# EAGLE design mini-ecg1 (EAGLE 9.4.2)
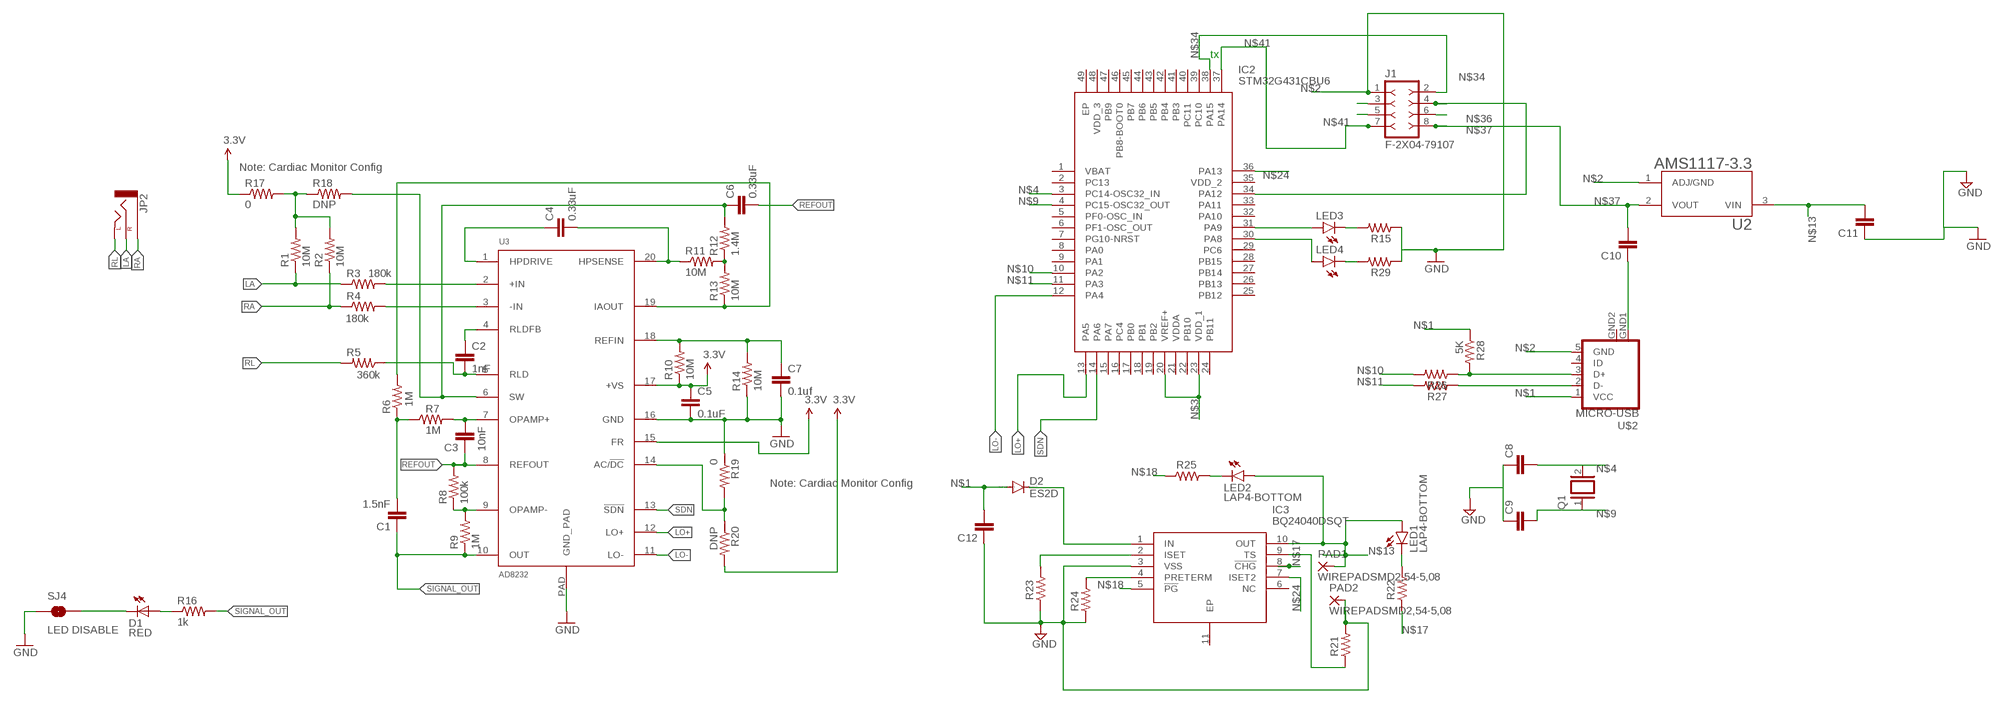
[diagram p0: schematic, sheet 1]

## Parts
C1  1.5nF  CAP0603-CAP  [0603-CAP]
C2  1nF  CAP0603-CAP  [0603-CAP]
C3  10nF  CAP0603-CAP  [0603-CAP]
C4  0.33uF  CAP0805  [0805]
C5  0.1uF  CAP0603-CAP  [0603-CAP]
C6  0.33uF  CAP0805  [0805]
C7  0.1uf  CAP0603-CAP  [0603-CAP]
C8  C-EUC1206  [C1206]
C9  C-EUC1206  [C1206]
C10  C-EUC1206  [C1206]
C11  C-EUC1206  [C1206]
C12  C-EUC1206  [C1206]
D1  RED  LED-RED0603  [LED-0603]
D2  ES2D  [SMB]
IC2  STM32G431CBU6  [QFN50P700X700X65-49N]
IC3  BQ24040DSQT  [SON40P200X200X80-11N]
J1  F-2X04-79107  [79107-08]
JP2  AUDIO-JACKSMD2  [AUDIO-JACK-3.5MM-SMD]
LED1  LAP4-BOTTOM  [P47F-BOTTOM]
LED2  LAP4-BOTTOM  [P47F-BOTTOM]
LED3  LEDCHIPLED_1206  [CHIPLED_1206]
LED4  LEDCHIPLED_1206  [CHIPLED_1206]
PAD1  WIREPADSMD2,54-5,08  [SMD2,54-5,08]
PAD2  WIREPADSMD2,54-5,08  [SMD2,54-5,08]
Q1  XTAL/S  [QS]
R1  10M  RESISTOR0603-RES  [0603-RES]
R2  10M  RESISTOR0603-RES  [0603-RES]
R3  180k  RESISTOR0603-RES  [0603-RES]
R4  180k  RESISTOR0603-RES  [0603-RES]
R5  360k  RESISTOR0603-RES  [0603-RES]
R6  1M  RESISTOR0603-RES  [0603-RES]
R7  1M  RESISTOR0603-RES  [0603-RES]
R8  100k  RESISTOR0603-RES  [0603-RES]
R9  1M  RESISTOR0603-RES  [0603-RES]
R10  10M  RESISTOR0603-RES  [0603-RES]
R11  10M  RESISTOR0603-RES  [0603-RES]
R12  1.4M  RESISTOR0603-RES  [0603-RES]
R13  10M  RESISTOR0603-RES  [0603-RES]
R14  10M  RESISTOR0603-RES  [0603-RES]
R15  R_1206  [R1206]
R16  1k  1K-1%  [0603-RES]
R17  0  0OHM1/10W5%(0603)  [0603]
R18  DNP  0OHM1/10W5%(0603)  [0603]
R19  0  0OHM1/10W5%(0603)  [0603]
R20  DNP  0OHM1/10W5%(0603)  [0603]
R21  R_1206  [R1206]
R22  R_1206  [R1206]
R23  R_1206  [R1206]
R24  R_1206  [R1206]
R25  R_1206  [R1206]
R26  R_1206  [R1206]
R27  R_1206  [R1206]
R28  5K  R_1206  [R1206]
R29  R_1206  [R1206]
SJ4  LED DISABLE  SOLDERJUMPERTRACE  [SJ_2S-TRACE]
U2  AMS1117-3.3  [SOT229P700X180-4N]
U3  AD8232  [LFCSP_20]
U$2  MICRO-USB  [MICRO-USB]

## Nets
3.3V: C5.1 R10.1 R17.1 R20.2 U3.15(FR) U3.17(+VS)
GND: C5.2 C7.2 C11.1 C12.1 IC3.3(VSS) PAD2.1(P) R14.1 R19.1 R21.2 R23.1 R24.1 SJ4.1 U3.16(GND) U3.PAD(GND_PAD)
LA: JP2.RING(RIGHT) R1.1 R3.1
LO+: IC2.13(PA5) U3.12(LO+)
LO-: IC2.12(PA4) U3.11(LO-)
N$1: C12.2 D2.A R28.1 U$2.1(VCC)
N$2: J1.1 R15.1 R29.1 U2.1(ADJ/GND) U$2.5(GND) ; supply symbol labelled GND
N$3: IC2.20(VREF+) IC2.23(VDD_1) R3.2 U3.2(+IN)
N$4: IC2.3(PC14-OSC32_IN) R4.2 U3.3(-IN)
N$5: C3.2 R7.2 U3.7(OPAMP+)
N$6: C4.2 R11.1 U3.20(HPSENSE)
N$7: C7.1 R10.2 R14.2 U3.18(REFIN)
N$8: R8.1 R9.2 U3.9(OPAMP-)
N$9: C1.2 IC2.4(PC15-OSC32_OUT) R6.1 R7.1
N$10: IC2.10(PA2) R26.1 R28.2 U$2.3(D+)
N$11: IC2.11(PA3)
N$12: C10.1 U$2.GND1(GND)
N$13: C4.1 C11.2 IC3.10(OUT) LED1.A LED2.A PAD1.1(P) U2.3(VIN) U3.1(HPDRIVE)
N$14: R11.2 R12.1 R13.2
N$15: R6.2 R13.1 U3.19(IAOUT)
N$16: C6.1 R12.2 R18.2 U3.6(SW)
N$17: C2.1 IC3.8(!CHG) R22.1 U3.4(RLDFB)
N$18: C2.2 IC3.5(!PG) R5.1 R25.1 U3.5(RLD)
N$19: D1.A R16.1
N$20: R1.2 R2.2 R17.2 R18.1
N$21: D1.C SJ4.2
N$22: R19.2 R20.1 U3.14(AC/!DC)
N$23: C8.2 Q1.2
N$24: C9.2 IC2.36(PA13) IC3.7(ISET2) LED2.C Q1.1 R25.2
N$25: C8.1 C9.1
N$26: IC3.9(TS) R21.1
N$27: LED1.C R22.2
N$28: IC3.2(ISET) R23.2
N$29: IC3.4(PRETERM) R24.2
N$30: D2.C IC3.1(IN)
N$31: R27.1 U$2.2(D-)
N$32: R26.2
N$33: R27.2
N$34: IC2.38(PA15) J1.2
N$35: IC2.34(PA12) J1.4
N$36: J1.6
N$37: C10.2 J1.8 U2.2(VOUT)
N$39: J1.3
N$40: J1.5
N$41: IC2.37(PA14) J1.7
N$44: IC2.31(PA9) LED3.A
N$45: LED3.C R15.2
N$46: IC2.30(PA8) LED4.A
N$47: LED4.C R29.2
RA: JP2.SLEEVE R2.1 R4.1
REFOUT: C3.1 C6.2 R8.2 U3.8(REFOUT)
RL: JP2.TIP(LEFT) R5.2
SDN: IC2.14(PA6) U3.13(!SDN)
SIGNAL_OUT: C1.1 R9.1 R16.2 U3.10(OUT)
Unconnected: IC2.1(VBAT) IC2.2(PC13) IC2.5(PF0-OSC_IN) IC2.6(PF1-OSC_OUT) IC2.7(PG10-NRST) IC2.8(PA0) IC2.9(PA1) IC2.15(PA7) IC2.16(PC4) IC2.17(PB0) IC2.18(PB1) IC2.19(PB2) IC2.21(VDDA) IC2.22(PB10) IC2.24(PB11) IC2.25(PB12) IC2.26(PB13) IC2.27(PB14) IC2.28(PB15) IC2.29(PC6) IC2.32(PA10) IC2.33(PA11) IC2.35(VDD_2) IC2.39(PC10) IC2.40(PC11) IC2.41(PB3) IC2.42(PB4) IC2.43(PB5) IC2.44(PB6) IC2.45(PB7) IC2.46(PB8-BOOT0) IC2.47(PB9) IC2.48(VDD_3) IC2.49(EP) IC3.6(NC) IC3.11(EP) U$2.4(ID)

## Notes on the sheet
- tx
- Note: Cardiac Monitor Config
- Note: Cardiac Monitor Config

## Power pins joined to a net without a drawn wire
GND: U$2.GND2(GND)

## Library data of the parts
C1-C7 = SparkFun-Passives:CAP: Capacitor Standard 0603 ceramic capacitor, and 0.1" leaded capacitor.
C8-C12 = rcl:C-EU: CAPACITOR, European symbol; SPICEPREFIX: C
D1 = SparkFun-LED:LED-RED: Assorted Red LEDs LilyPad 1206- DIO-09912 1206- DIO-00809 0603- DIO-00819; PROD_ID: DIO-00819
D2 = diode:ES2D: DIODE super fast rectifier, 2 A
IC2 = SamacSys_Parts:STM32G431CBU6: STMICROELECTRONICS - STM32G431CBU6 - MCU, 32BIT, 170MHZ, UFQFPN-48 Source: Datasheet <https://componentsearchengine.com/Datasheets/1/STM32G431CBU6.pdf>; DESCRIPTION: STMICROELECTRONICS - STM32G431CBU6 - MCU, 32BIT, 170MHZ, UFQFPN-48; HEIGHT: 0.65mm; MANUFACTURER_NAME: STMicroelectronics; MANUFACTURER_PART_NUMBER: STM32G431CBU6; MOUSER_PART_NUMBER: 511-STM32G431CBU6; MOUSER_PRICE-STOCK: https://www.mouser.com/Search/Refine.aspx?Keyword=511-STM32G431CBU6
IC3 = SamacSys_Parts:BQ24040DSQT: 1A 1-Cell Li-Ion Battery Charger WSON10 Texas Instruments BQ24040DSQT, Battery Charge Controller, 1000mA, 10-Pin SON Source: Datasheet <http://www.ti.com/lit/ds/symlink/bq24040.pdf>; DESCRIPTION: 1A 1-Cell Li-Ion Battery Charger WSON10 Texas Instruments BQ24040DSQT, Battery Charge Controller, 1000mA, 10-Pin SON; HEIGHT: 0.8mm; MANUFACTURER_NAME: Texas Instruments; MANUFACTURER_PART_NUMBER: BQ24040DSQT; MOUSER_PART_NUMBER: 595-BQ24040DSQT; MOUSER_PRICE-STOCK: https://www.mouser.com/Search/Refine.aspx?Keyword=595-BQ24040DSQT
J1 = con-headers-jp:F-2X04-: FEMALE HEADER
JP2 = SparkFun-Connectors:AUDIO-JACK: 3.5mm Audio Jack Simple 3.5mm common PCB mount audio jack. SKU: PRT-08032; PROD_ID: CONN-10353
LED1 LED2 = led:*P4: PointLED® Enhanced Thinfilm LED TOP & BOTTOM mount LS P47F, LR P47F, LA P47F, LY P47F, LT P4SG, LB P4SG, LW P4SG Source: http://catalog.osram-os.com .. LA_LR_LS_LY_P47F_Pb_free.pdf
LED3 LED4 = led:LED: LED OSRAM: - CHIPLED LG R971, LG N971, LY N971, LG Q971, LY Q971, LO R971, LY R971 LH N974, LH R974 LS Q976, LO Q976, LY Q976 LO Q996 - Hyper CHIPLED LW Q18S LB Q993, LB Q99A, LB R99A - SideLED LS A670, LO A670, LY A670, LG A670, LP A670 LB A673, LV A673, LT A673, LW A673 LH A674 LY A675 LS A676, LA A676, LO A676, LY A676, LW A676 LS A679, LY A679, LG A679 - Hyper Micro SIDELED® LS Y876, LA Y876, LO Y876, LY Y876 LT Y87S - SmartLED LW L88C, LW L88S LB L89C, LB L89S, LG L890 LS L89K, LO L89K, LY L89K LS L896, LA L896, LO L896, LY L896 - TOPLED LS T670, LO T670, LY T670, LG T670, LP T670 LSG T670, LSP T670, LSY T670, LOP T670, LYG T670 LG T671, LOG T671, LSG T671 LB T673, LV T673, LT T673, LW T673 LH T674 LS T676, LA T676, LO T676, LY T676, LB T676, LH T676, LSB T676, LW T676 LB T67C, LV T67C, LT T67C, LS T67K, LO T67K, LY T67K, LW E67C LS E67B, LA E67B, LO E67B, LY E67B, LB E67C, LV E67C, LT E67C LW T67C LS T679, LY T679, LG T679 LS T770, LO T770, LY T770, LG T770, LP T770 LB T773, LV T773, LT T773, LW T773 LH T774 LS E675, LA E675, LY E675, LS T675 LS T776, LA T776, LO T776, LY T776, LB T776 LHGB T686 LT T68C, LB T68C - Hyper Mini TOPLED® LB M676 - Mini TOPLED Santana® LG M470 LS M47K, LO M47K, LY M47K Source: http://www.osram.convergy.de LUXEON: - LUMILED® LXK2-PW12-R00, LXK2-PW12-S00, LXK2-PW14-U00, LXK2-PW14-V00 LXK2-PM12-R00, LXK2-PM12-S00, LXK2-PM14-U00 LXK2-PE12-Q00, LXK2-PE12-R00, LXK2-PE12-S00, LXK2-PE14-T00, LXK2-PE14-U00 LXK2-PB12-K00, LXK2-PB12-L00, LXK2-PB12-M00, LXK2-PB14-N00, LXK2-PB14-P00, LXK2-PB14-Q00 LXK2-PR12-L00, LXK2-PR12-M00, LXK2-PR14-Q00, LXK2-PR14-R00 LXK2-PD12-Q00, LXK2-PD12-R00, LXK2-PD12-S00 LXK2-PH12-R00, LXK2-PH12-S00 LXK2-PL12-P00, LXK2-PL12-Q00, LXK2-PL12-R00 Source: www.luxeon.com KINGBRIGHT: KA-3528ASYC Source: www.kingbright.com
PAD1 PAD2 = wirepad:WIREPAD: Wire PAD connect wire on PCB
Q1 = special:XTAL/S: CRYSTAL
R1-R14 = SparkFun-Passives:RESISTOR: Resistor Basic schematic elements and footprints for 0603, 1206, and PTH resistors.
R15 R21-R29 = rc-master-smd:R_: RESISTOR
R16 = SparkFun-Resistors:1K-1%: 1k-ohm SMT 1/10W - 1% (0603) RES-07856; PROD_ID: RES-07856
R17 R19 = SparkFun-Resistors:0OHM1/10W5%(0603): RES-08609; PROD_ID: RES-08609
R18 R20 = SparkFun-Resistors:0OHM1/10W5%(0603): RES-08609; PROD_ID: RES-08609; VALUE: 0
SJ4 = SparkFun-Passives:SOLDERJUMPER: Solder Jumper Standard SMD solder jumper. Used to automate production. Two varients : Normally Open and Normally Closed are the same, but have different paste layers. NC will have a large amount of paste and should jumper during reflow.
U2 = AMS1117-3.3:AMS1117-3.3: Sot223/Pkg 1-Amp 3.3-Volt Low Drop Out Voltage Regulatator; AVAILABILITY: Unavailable; DESCRIPTION: Sot223/Pkg 1-Amp 3.3-Volt Low Drop Out Voltage Regulatator; MF: Advanced Monolithic Systems; MP: AMS1117-3.3; PACKAGE: None; PRICE: None
U3 = ad8232:AD8232
U$2 = microusb:MICRO-USB: Micro USB B connector

## Board
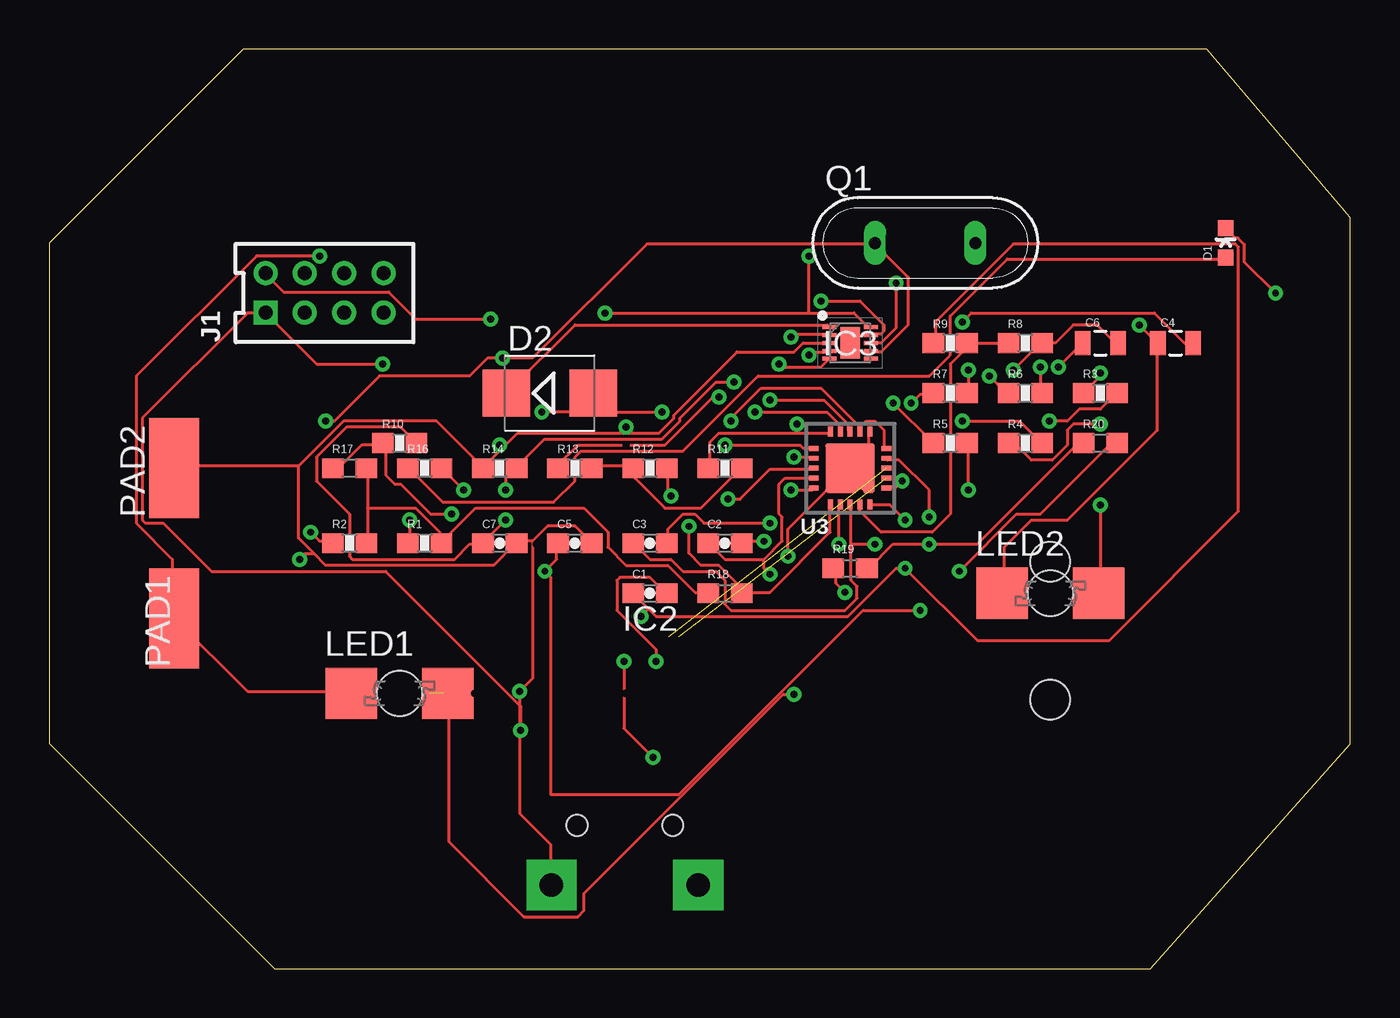
[diagram p1: board, top side]
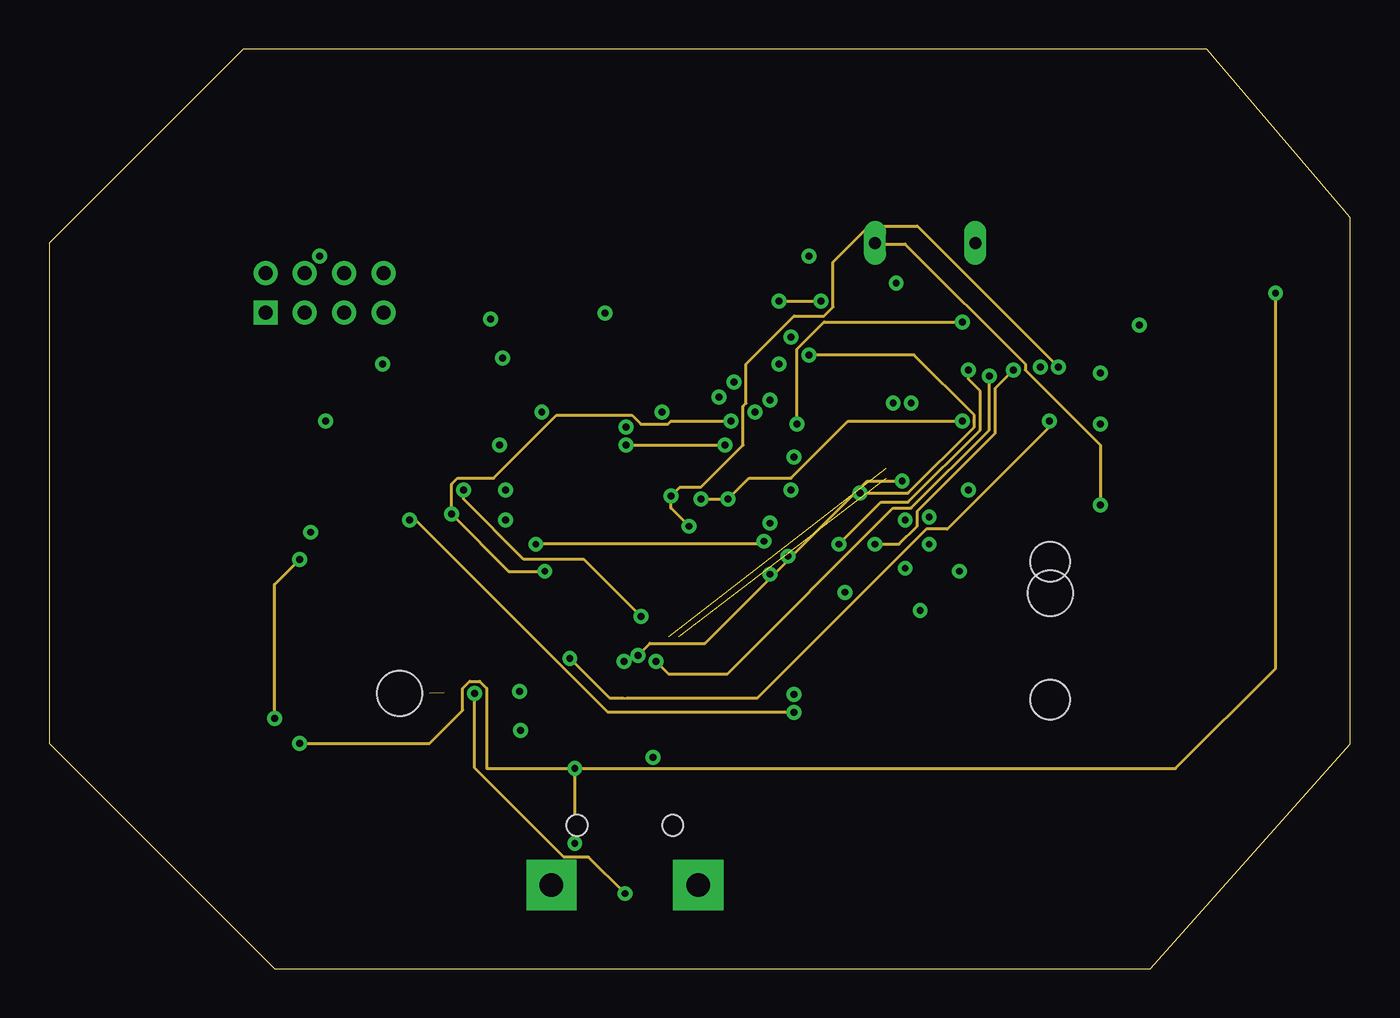
[diagram p2: board, inner layer Route2]
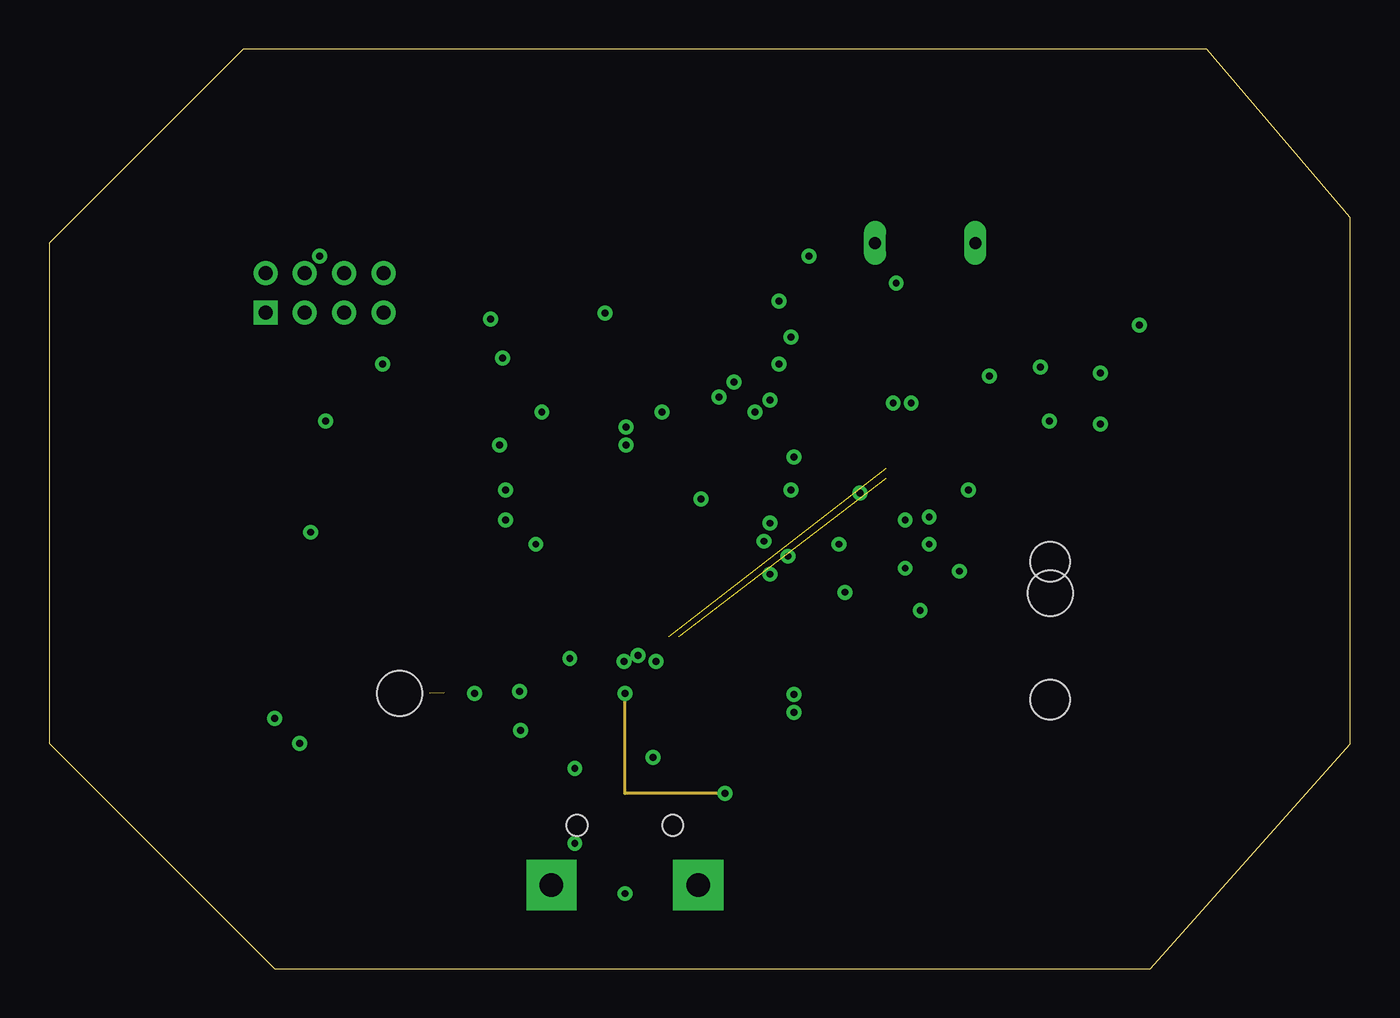
[diagram p3: board, inner layer Route3]
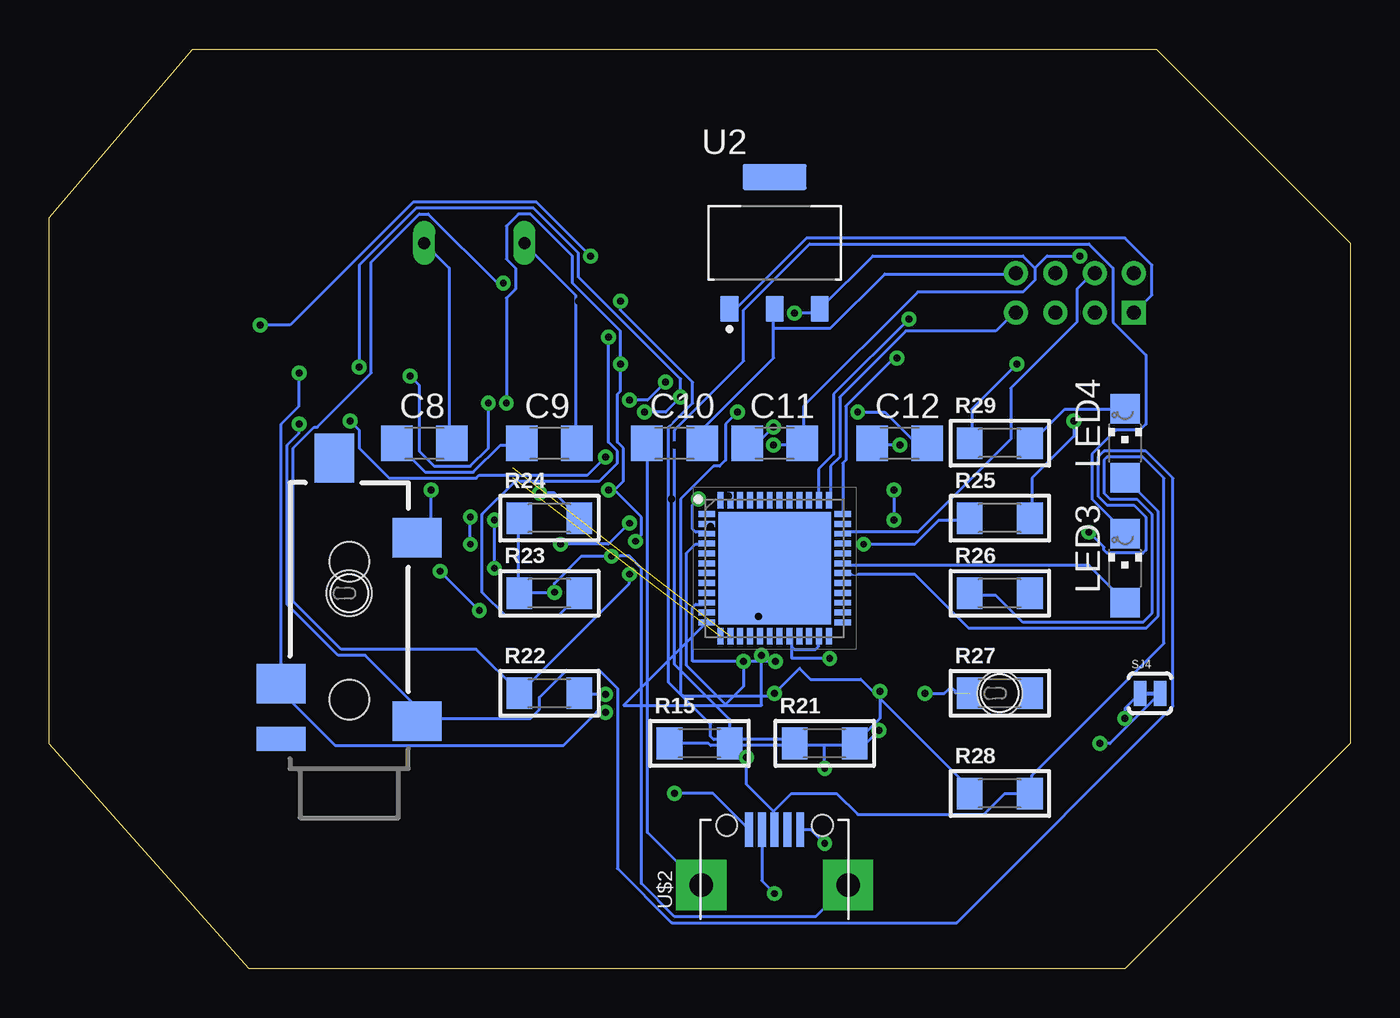
[diagram p4: board, bottom side, seen from below]

Size 66.02 x 46.66 mm. Coordinates in mm from the lower left corner, seen from the top.
Outline: 66.02,11.41 66.02,38.12 58.75,46.66 9.83,46.66 0,36.83 0,11.43 11.43,0 55.88,0 66.02,11.41
Copper layers ([3:[[2:[1+2*3+14*15+16:3]]:2]]): Top 0.035mm / dielectric 1.5mm / Route2 0.035mm / dielectric 0.15mm / Route3 0.035mm / dielectric 0.2mm / Route14 0.035mm / dielectric 0.15mm / Route15 0.035mm / dielectric 0.2mm / Bottom 0.035mm
Design rules "default *": minimum track width 6mil, minimum drill 0.35mm, track to track 6mil, track to pad 6mil, pad to pad 6mil, via to via 6mil, smd to smd 6mil, copper to edge 40mil, drill to drill 6mil, minimum pad ring 10mil, minimum via ring 8mil, stop-mask expansion 4mil, vias tented up to drill 0mil, thermal gap 10mil

### Footprints (pad centres in the part's own frame; a part is rotated, then mirrored left to right if it is on the bottom)
0603-CAP = smd 1.1 x 1: 1 -0.85,0; 2 0.85,0
0805 = smd 0.8 x 1.2: 1 -0.9,0; 2 0.9,0
C1206 = smd 1.6 x 1.8: 1 -1.4,0; 2 1.4,0
LED-0603 = smd 0.8 x 0.8: A 0,-0.75; C 0,0.75
SMB = smd 2.4 x 2.4: A 2.2,0; C -2.2,0
QFN50P700X700X65-49N = smd 0.85 x 0.3: 1 -3.45,2.75; 2 -3.45,2.25; 3 -3.45,1.75; 4 -3.45,1.25; 5 -3.45,0.75; 6 -3.45,0.25; 7 -3.45,-0.25; 8 -3.45,-0.75; 9 -3.45,-1.25; 10 -3.45,-1.75; 11 -3.45,-2.25; 12 -3.45,-2.75; 25 3.45,-2.75; 26 3.45,-2.25; 27 3.45,-1.75; 28 3.45,-1.25; 29 3.45,-0.75; 30 3.45,-0.25; 31 3.45,0.25; 32 3.45,0.75; 33 3.45,1.25; 34 3.45,1.75; 35 3.45,2.25; 36 3.45,2.75 | smd 0.3 x 0.85: 13 -2.75,-3.45; 14 -2.25,-3.45; 15 -1.75,-3.45; 16 -1.25,-3.45; 17 -0.75,-3.45; 18 -0.25,-3.45; 19 0.25,-3.45; 20 0.75,-3.45; 21 1.25,-3.45; 22 1.75,-3.45; 23 2.25,-3.45; 24 2.75,-3.45; 37 2.75,3.45; 38 2.25,3.45; 39 1.75,3.45; 40 1.25,3.45; 41 0.75,3.45; 42 0.25,3.45; 43 -0.25,3.45; 44 -0.75,3.45; 45 -1.25,3.45; 46 -1.75,3.45; 47 -2.25,3.45; 48 -2.75,3.45 | smd 5.7 x 5.7: 49 0,0
SON40P200X200X80-11N = smd 0.7 x 0.2: 1 -1.05,0.8; 2 -1.05,0.4; 3 -1.05,0; 4 -1.05,-0.4; 5 -1.05,-0.8; 6 1.05,-0.8; 7 1.05,-0.4; 8 1.05,0; 9 1.05,0.4; 10 1.05,0.8 | smd 1 x 1.6: 11 0,0
79107-08 = drill 0.711 square: 1 -3,-1 | drill 0.711: 2 -3,1; 3 -1,-1; 4 -1,1; 5 1,-1; 6 1,1; 7 3,-1; 8 3,1
AUDIO-JACK-3.5MM-SMD = smd 2 x 2.5: RING 4.3,3.45; SLEEVE 2.4,-3.45; TIP 11.7,-3.45 | smd 1.2 x 2.5: RSH 1.5,3.45 | smd 2.5 x 2: TSH 15.75,0.75 | hole 2: 3.5,0; 10.5,0
P47F-BOTTOM = smd 2.6 x 2.6: A -2.45,0; C 2.45,0 | hole 2.3: 0,0
CHIPLED_1206 = smd 1.5 x 1.5: A 0,-1.75; C 0,1.75
SMD2,54-5,08 = smd 2.54 x 5.08: 1 0,0
QS = drill 0.61 long: 1 -2.54,0; 2 2.54,0
0603-RES = smd 1.1 x 1: 1 -0.85,0; 2 0.85,0
R1206 = smd 1.3 x 1.6: 1 -1.524,0; 2 1.524,0
0603 = smd 1.1 x 1: 1 -0.85,0; 2 0.85,0
SJ_2S-TRACE = smd 0.635 x 1.27: 1 -0.508,0; 2 0.508,0
SOT229P700X180-4N = smd 0.93 x 1.31: 1 -2.29,-3.345; 2 0,-3.345; 3 2.29,-3.345 | smd 3.24 x 1.31: 4 0,3.345
LFCSP_20 = smd 0.5 x 0.25: 1 -1.85,1; 2 -1.85,0.5; 3 -1.85,0; 4 -1.85,-0.5; 5 -1.85,-1; 11 1.85,-1; 12 1.85,-0.5; 13 1.85,0; 14 1.85,0.5; 15 1.85,1 | smd 0.25 x 0.5: 6 -1,-1.85; 7 -0.5,-1.85; 8 0,-1.85; 9 0.5,-1.85; 10 1,-1.85; 16 1,1.85; 17 0.5,1.85; 18 0,1.85; 19 -0.5,1.85; 20 -1,1.85 | smd 2.5 x 2.5: PAD 0,0
MICRO-USB = smd 0.4 x 1.75: 1 -1.3,4.525; 2 -0.65,4.525; 3 0,4.525; 4 0.65,4.525; 5 1.3,4.525 | drill 1.2 pad 2.54 square: GND1 -3.725,1.7; GND2 3.725,1.7 | hole 1.05: -2.425,4.73; 2.425,4.73

### Placement (x,y rotation side)
C1  30.48,19.05 0 top
C2  34.29,21.59 0 top
C3  30.48,21.59 0 top
C4  57.15,31.75 0 top
C5  26.67,21.59 0 top
C6  53.34,31.75 0 top
C7  22.86,21.59 0 top
C8  46.99,26.67 0 bottom
C9  40.64,26.67 0 bottom
C10  34.29,26.67 0 bottom
C11  29.21,26.67 0 bottom
C12  22.86,26.67 0 bottom
D1  59.69,36.83 0 top
D2  25.4,29.21 0 top
IC2  29.21,20.32 0 bottom
IC3  40.64,31.75 0 top
J1  13.97,34.29 0 top
JP2  50.8,10.16 90 bottom
LED1  17.78,13.97 0 top
LED2  50.8,19.05 0 top
LED3  11.43,20.32 0 bottom
LED4  11.43,26.67 0 bottom
PAD1  6.35,17.78 0 top
PAD2  6.35,25.4 0 top
Q1  44.45,36.83 0 top
R1  19.05,21.59 0 top
R2  15.24,21.59 0 top
R3  53.34,29.21 0 top
R4  49.53,26.67 0 top
R5  45.72,26.67 0 top
R6  49.53,29.21 0 top
R7  45.72,29.21 0 top
R8  49.53,31.75 0 top
R9  45.72,31.75 0 top
R10  17.78,26.67 0 top
R11  34.29,25.4 0 top
R12  30.48,25.4 0 top
R13  26.67,25.4 0 top
R14  22.86,25.4 0 top
R15  33.02,11.43 0 bottom
R16  19.05,25.4 0 top
R17  15.24,25.4 0 top
R18  34.29,19.05 0 top
R19  40.64,20.32 0 top
R20  53.34,26.67 0 top
R21  26.67,11.43 0 bottom
R22  40.64,13.97 0 bottom
R23  40.64,19.05 0 bottom
R24  40.64,22.86 0 bottom
R25  17.78,22.86 0 bottom
R26  17.78,19.05 0 bottom
R27  17.78,13.97 0 bottom
R28  17.78,8.89 0 bottom
R29  17.78,26.67 0 bottom
SJ4  10.16,13.97 0 bottom
U2  29.21,36.83 0 bottom
U3  40.64,25.4 0 top
U$2  29.21,2.54 0 bottom

### Tracks (layer width: path | path; a pad name or v marks a point on that pad's centre or on a via)
3.3V  (via drill 0.35, 0.35 layers 1-2)
  Top 0.152: 41.15,27.48 41.45,27.79 41.91,27.79 42.37,27.33 42.37,26.42 U3.15 | 41.15,27.48 41.15,27.33 U3.17 41.15,27.48 | R17.1 14.48,25.5 14.78,25.5 15.85,26.57 16.92,26.57 R10.1 17.07,26.57 17.07,25.04 17.53,24.59 17.83,24.59 19.36,23.06 v20.42,23.06 | C5.1 25.76,21.54 25.76,20.78 v25.15,20.17 25.45,19.86 25.45,8.84 31.95,8.84 41.3,18.19 v44.2,18.19 | v46.18,20.17 49.07,23.06 50.29,23.06 53.8,26.57 54.1,26.57 R20.2 | 41.15,27.48 39.17,29.46 36.12,29.46 34.59,27.94 v34.59,27.79
  Route2 0.152: v25.15,20.17 23.32,20.17 v20.42,23.06 20.42,24.59 20.73,24.89 22.55,24.89 25.76,28.09 29.57,28.09 30.02,27.63 31.39,27.63 31.55,27.79 v34.59,27.79
  Bottom 0.152: v44.2,18.19 v46.18,20.17
GND  (via drill 0.35, 0.35 layers 1-2, 0.35 layers 2-16)
  Top 0.152: IC3.3 38.25,31.75 37.79,31.29 34.9,31.29 31.7,28.09 31.7,27.94 30.94,27.18 29.26,27.18 | 29.26,27.18 23.77,27.18 23.01,26.42 | 23.01,26.42 22.1,25.5 R14.1 21.95,25.5 19.66,27.79 14.94,27.79 12.65,25.5 | 23.01,26.42 v22.86,26.57 | 29.26,27.18 v29.26,27.48 | 12.65,25.5 6.4,25.5 PAD2.1 | U3.16 41.6,27.18 41.6,26.42 40.69,25.5 U3.PAD 40.54,25.35 37.49,22.3 v37.49,20.93 | v40.39,19.1 39.93,19.56 39.93,20.32 R19.1 | 24.54,21.69 23.77,21.69 C7.2 23.62,21.54 22.55,20.47 14.02,20.47 13.44,21.06 | 24.54,21.69 25.3,22.45 26.67,22.45 27.43,21.69 C5.2 | 24.54,21.69 24.54,14.73 v23.88,14.07 23.88,7.87 25.45,6.3 25.45,4.32 U$2.GND2 | 12.65,25.5 12.65,21.84 13.44,21.06 | v12.7,20.77 12.98,21.06 13.44,21.06
  Route2 0.152: v11.43,12.7 11.43,19.5 v12.7,20.77
  Bottom 0.152: v22.86,26.57 24.23,26.57 C12.1 | v29.26,27.48 30.02,26.72 30.48,26.72 C11.1 | R24.1 42.21,22.76 42.21,19.1 R23.1 42.06,19.1 v40.39,19.1 40.39,19.56 39.01,20.93 v37.49,20.93 36.58,20.93 35.97,20.32 35.97,4.32 34.29,2.64 27.13,2.64 25.6,4.17 U$2.GND2 | v23.88,14.07 23.88,12.7 R21.2 | SJ4.1 11.43,13.21 v11.43,12.7
LA  (via drill 0.35, 0.35 layers 1-2, 0.35 layers 2-16)
  Top 0.152: v18.29,22.76 18.29,21.69 R1.1 | v53.34,30.23 53.34,30.07 52.58,29.31 R3.1
  Route2 0.152: v18.29,22.76 18.59,22.76 28.35,13 v37.79,13
  Bottom 0.152: v37.79,13 38.25,13 39.93,11.33 51.51,11.33 54.1,13.92 54.1,14.38 JP2.RING 54.25,14.53 54.25,27.63 53.34,28.55 v53.34,30.23
LO+  (1 unrouted)
LO-  (via drill 0.35 layers 1-2, 0.35 layers 2-16)
  Top 0.152: v43.28,24.74 42.98,24.43 42.52,24.43 U3.11
  Route2 0.152: v43.28,24.74 41.5,24.74 33.27,16.51 30.48,16.51 v29.87,15.9
  Bottom 0.152: v29.87,15.9 29.87,13.36 36.87,13.36 IC2.12
N$1  (via drill 0.35, 0.35 layers 3-16)
  Top 0.152: v31.09,28.25 28.65,28.25 27.74,29.16 D2.A 27.58,29.16 26.67,28.25 v24.99,28.25
  Route3 0.152: v34.29,8.89 29.21,8.89 v29.21,13.97
  Bottom 0.152: v31.09,28.25 31.7,27.63 31.7,25.81 32,25.5 32.31,25.5 33.98,23.82 33.98,13.97 33.86,13.84 29.34,13.84 v29.21,13.97 27.94,15.24 27.38,14.68 24.84,14.68 19.36,9.2 19.36,8.89 R28.1 | v24.99,28.25 23.62,28.25 22.1,26.72 21.49,26.72 C12.2 | U$2.1 32.34,8.89 v34.29,8.89
N$2  (via drill 0.35, 0.35 layers 2-16)
  Top 0.152: v23.93,12.09 23.93,13.31 17.07,20.17 8.23,20.17 5.79,22.61 4.88,22.61 4.72,22.76 4.72,27.94 10.06,33.27 10.82,33.27 J1.1 10.97,33.27 13.56,30.68 v16.92,30.68
  Route2 0.152: v26.67,6.35 v26.67,10.16
  Bottom 0.152: U2.1 31.39,33.58 31.09,33.58 27.58,37.08 11.43,37.08 10.06,35.71 10.06,34.19 10.82,33.43 J1.1 | R15.1 32.56,11.43 32.46,11.33 26.67,11.33 | 26.67,11.33 24.69,11.33 v23.93,12.09 | v16.92,30.68 19.2,28.4 19.2,26.72 R29.1 | U$2.5 27.39,7.06 v26.67,6.35 | v26.67,10.16 26.67,11.33
N$3  (via drill 0.35, 0.35 layers 2-16)
  Top 0.152: v37.79,25.96 38.71,25.96 U3.2 | v50.75,27.79 51.66,27.79 52.27,28.4 53.34,28.4 54.1,29.16 R3.2
  Route2 0.152: v26.42,15.75 28.45,13.72 35.92,13.72 44.5,22.3 45.57,22.3 50.75,27.48 v50.75,27.79
  Bottom 0.152: 28.35,16.36 28.19,16.21 27.13,16.21 26.98,16.36 26.98,16.82 IC2.23 | 28.35,16.36 28.35,16.82 IC2.20 | 28.35,16.36 28.35,15.75 v26.42,15.75 | v37.79,25.96 38.71,25.04 44.2,25.04 44.35,24.89 48.77,24.89 50.29,26.42 50.29,27.33 v50.75,27.79
N$4  (via drill 0.35 layers 1-2, 0.35 layers 2-16)
  Top 0.152: v34.44,23.82 35.05,23.82 36.58,25.35 38.71,25.35 U3.3 | v46.33,27.79 49.22,27.79 50.29,26.72 R4.2
  Route2 0.152: v33.07,23.82 v34.44,23.82 35.51,24.89 37.64,24.89 40.54,27.79 v46.33,27.79
  Bottom 0.152: v33.07,23.82 33.38,23.52 33.38,22.3 33.22,22.15 32.77,22.15 IC2.3
N$5  (via drill 0.35, 0.35 layers 1-2)
  Top 0.152: v40.08,21.54 40.08,23.52 U3.7 | v36.58,22.61 33.22,22.61 32.77,23.06 32.16,23.06 31.39,22.3 31.39,21.69 C3.2 | v46.63,30.38 46.63,29.31 R7.2
  Route2 0.152: v46.63,30.38 46.63,29.92 47.24,29.31 47.24,27.33 43.59,23.67 42.21,23.67 v40.08,21.54
  Bottom 0.152: v40.08,21.54 37.64,21.54 v36.58,22.61
N$6  (via drill 0.35 layers 1-2)
  Top 0.152: 37.95,27.18 33.98,27.18 33.53,26.72 33.53,25.5 R11.1 | 37.95,27.18 39.62,27.18 U3.20 | C4.2 57.61,31.75 56.08,33.27 46.79,33.27 v46.33,32.82 | 37.95,27.18 v37.95,27.63
  Route2 0.152: v46.33,32.82 39.32,32.82 37.95,31.45 v37.95,27.63
N$7  (via drill 0.35)
  Top 0.152: R10.2 18.59,26.72 17.83,27.48 15.09,27.48 13.56,25.96 13.56,24.74 15.24,23.06 15.24,20.93 15.39,20.78 20.57,20.78 21.34,21.54 21.95,21.54 C7.1 22.1,21.69 v23.17,22.76 | v36.58,28.85 39.32,28.85 40.54,27.63 40.54,27.33 U3.18 | v34.75,29.77 33.83,29.77 32,27.94 32,27.79 31.09,26.87 25.15,26.87 23.77,25.5 R14.2 23.62,25.35 23.17,24.89 v23.17,24.28
  Bottom 0.152: v36.58,28.85 35.66,28.85 v34.75,29.77 | v23.17,24.28 v23.17,22.76
N$8
  Top 0.152: U3.9 41.15,23.52 41.15,23.22 42.21,22.15 44.81,22.15 45.72,23.06 45.72,30.68 46.48,31.45 46.48,31.75 R9.2 R8.1
N$9  (via drill 0.35)
  Top 0.152: v43.74,28.7 44.2,29.16 44.81,29.16 R7.1 | v47.7,30.07 48.62,29.16 R6.1 | v30.79,15.6 30.79,16.21 28.8,18.19 28.8,19.71 28.96,19.86 30.48,19.86 31.24,19.1 C1.2
  Route2 0.152: v47.7,30.07 47.7,27.33 43.74,23.37 42.82,23.37 34.39,14.93 31.45,14.93 v30.79,15.6
  Bottom 0.152: v43.74,28.7 43.74,26.42 44.65,25.5 46.48,25.5 47.24,26.26 47.24,29.62 v47.7,30.07 | v30.79,15.6 30.79,14.33 31.7,13.41 33.68,15.39 33.68,21.08 33.22,21.54 32.77,21.54 IC2.4
N$10  (via drill 0.35)
  Top 0.152: v29.16,15.6 29.16,12.19 v30.63,10.72
  Bottom 0.152: v29.16,15.6 33.38,15.6 33.38,18.34 33.22,18.49 32.77,18.49 IC2.10 | v30.63,10.72 30.63,9.35 29.26,7.98 | 29.26,7.98 29.26,7.21 U$2.3 | 29.26,7.98 28.35,8.89 26.06,8.89 24.99,7.82 18.59,7.82 17.53,8.89 R28.2 16.15,8.89 16.15,9.8 9.45,16.51 9.45,24.89 10.52,25.96 12.34,25.96 12.5,25.81 12.5,24.13 12.19,23.82 10.82,23.82 10.06,23.06 10.06,18.03 10.52,17.58 16.61,17.58 17.98,18.95 19.2,18.95 R26.1
N$12
  Bottom 0.152: C10.1 35.66,26.57 35.66,6.91 33.07,4.32 U$2.GND1
N$13  (via drill 0.35, 0.35 layers 1-2, 0.35 layers 2-16)
  Top 0.152: 56.24,31.75 56.24,27.33 51.66,22.76 49.84,22.76 48.46,21.39 48.46,19.1 LED2.A | LED1.A 15.24,14.07 10.06,14.07 PAD1.1 6.25,17.88 6.25,20.78 4.42,22.61 4.42,30.07 10.52,36.17 v13.72,36.17 | v34.29,26.57 38.1,26.57 38.25,26.42 38.71,26.42 U3.1 | v28.19,33.27 38.56,33.27 | 38.56,33.27 40.84,33.27 41.6,32.51 IC3.10 | v55.32,32.66 56.24,31.75 | 38.56,33.27 v38.56,36.17 | 56.24,31.75 C4.1
  Route2 0.152: v29.26,26.57 v34.29,26.57
  Bottom 0.152: v29.26,26.57 27.89,26.57 C11.2 27.74,26.72 27.74,28.55 21.95,34.34 16.61,34.34 16,34.95 16,35.56 | v28.19,33.27 27.13,33.27 26.98,33.43 U2.3 26.82,33.58 24.23,36.17 16.61,36.17 16,35.56 | v13.72,36.17 15.39,36.17 16,35.56 | v55.32,32.66 53.8,32.66 47.55,38.91 41.3,38.91 v38.56,36.17
N$14
  Top 0.152: R13.2 27.58,25.5 29.57,25.5 R12.1 29.72,25.35 29.72,24.89 31.24,23.37 33.07,23.37 35.05,25.35 R11.2
N$15  (via drill 0.35)
  Top 0.152: v35.81,28.25 39.47,28.25 40.08,27.63 40.08,27.33 U3.19 | v33.98,29.01 33.68,29.01 31.24,26.57 26.82,26.57 25.76,25.5 R13.1 | v50.29,30.53 50.29,29.31 R6.2
  Bottom 0.152: v35.81,28.25 34.75,28.25 v33.98,29.01 33.98,29.92 39.17,35.1 39.17,36.32 41.45,38.61 47.4,38.61 50.29,35.71 v50.29,30.53
N$16  (via drill 0.35 layers 1-2)
  Top 0.152: 35.36,19.1 35.2,19.1 R18.2 35.36,19.1 | 35.36,19.1 36.58,19.1 39.62,22.15 39.62,23.52 U3.6 | v31.55,23.98 31.39,24.13 31.39,25.35 R12.2 | v32.46,22.45 32.46,21.08 33.07,20.47 33.98,20.47 35.36,19.1 | v51.21,30.53 52.43,31.75 C6.1
  Route2 0.152: v32.46,22.45 31.55,23.37 v31.55,23.98 32,24.43 33.07,24.43 35.2,26.57 35.2,28.55 35.36,28.7 35.36,30.68 37.79,33.12 39.32,33.12 39.78,33.58 39.78,35.87 41.6,37.69 44.04,37.69 v51.21,30.53
N$17  (via drill 0.35)
  Top 0.152: 36.27,20.78 37.19,21.69 37.19,22.91 37.03,23.06 37.03,24.59 37.34,24.89 38.71,24.89 U3.4 | 36.27,20.78 34.29,20.78 33.53,21.54 C2.1 | IC3.8 42.21,31.75 42.98,32.51 v42.98,34.8 | 36.27,20.78 36.27,20.32 v36.58,20.02
  Bottom 0.152: v42.98,34.8 43.28,34.8 46.79,38.3 47.24,38.3 49.68,35.87 49.68,30.23 52.43,27.48 52.58,27.48 53.64,26.42 53.64,18.64 51.21,16.21 44.35,16.21 42.21,14.07 R22.1 36.58,19.56 v36.58,20.02
N$18  (via drill 0.35, 0.35 layers 2-16)
  Top 0.152: v37.64,24.28 38.71,24.28 U3.5 | v36.27,21.69 35.2,21.69 C2.2 | v37.03,30.68 37.19,30.53 39.17,30.53 39.62,30.99 IC3.5 | v42.82,28.7 44.81,26.72 R5.1
  Route2 0.152: v24.69,21.54 36.12,21.54 v36.27,21.69
  Bottom 0.152: 37.34,24.28 35.97,22.91 35.97,22 v36.27,21.69 | 37.34,24.28 36.88,24.74 36.88,26.42 37.19,26.72 37.19,29.16 37.03,29.31 v37.03,30.68 37.03,32.36 39.47,34.8 39.47,36.17 41.6,38.3 42.21,38.3 42.82,37.69 42.82,36.02 42.37,35.56 42.37,34.49 42.82,34.04 v42.82,28.7 | 37.34,24.28 v37.64,24.28 | v24.69,21.54 22.1,21.54 20.88,22.76 19.36,22.76 R25.1
N$19
  Top 0.152: D1.A 59.59,36.02 48.62,36.02 45.72,33.12 45.72,31.14 44.65,30.07 35.97,30.07 32.16,26.26 26.98,26.26 26.67,25.96 26.67,24.74 25.6,23.67 19.96,23.67 18.29,25.35 R16.1
N$20
  Top 0.152: 16.15,23.37 16.15,25.35 R17.2 | 16.15,23.37 16.15,21.69 R2.2 | 16.15,23.37 18.59,23.37 19.81,22.15 19.81,21.69 R1.2 19.96,21.69 21.64,23.37 27.13,23.37 28.35,22.15 28.35,21.39 29.26,20.47 31.39,20.47 32.77,19.1 33.38,19.1 R18.1
N$21  (via drill 0.35 layers 1-2, 0.35 layers 2-16)
  Top 0.152: v62.23,34.29 60.66,35.87 60.66,36.75 60.32,37.08 60.19,37.08 D1.C
  Route2 0.152: v12.7,11.43 19.3,11.43 20.98,13.12 20.98,14.22 21.34,14.58 21.84,14.58 22.2,14.22 22.2,10.16 57.15,10.16 62.23,15.24 v62.23,34.29
  Bottom 0.152: SJ4.2 12.19,11.43 v12.7,11.43
N$22  (via drill 0.35)
  Top 0.152: v44.65,22.91 44.65,24.28 43.13,25.81 42.52,25.81 U3.14 | R19.2 41.6,20.32 42.82,21.54 v44.65,21.54 47.09,21.54 52.12,26.57 52.43,26.57 R20.1
  Bottom 0.152: v44.65,21.54 v44.65,22.91
N$23
  Bottom 0.152: Q1.2 45.72,35.56 45.72,26.72 C8.2
N$24  (via drill 0.35, 0.35 layers 1-2)
  Top 0.152: 41.91,36.78 43.59,35.1 43.59,32.66 42.21,31.29 41.76,31.29 IC3.7 | 41.91,36.78 30.33,36.78 24.54,30.99 v23.01,30.99 22.25,30.99 21.34,30.07 16.76,30.07 14.48,27.79 v14.02,27.79 | 41.91,36.78 Q1.1 | v53.34,23.52 53.34,19.1 LED2.C
  Route2 0.152: v53.34,23.52 53.34,26.57 49.53,30.38 49.53,30.68 43.43,36.78 41.91,36.78 Q1.1
  Bottom 0.152: v23.01,30.99 23.17,30.99 25.6,28.55 25.6,25.81 25.76,25.65 25.76,23.22 IC2.36 | v14.02,27.79 14.02,27.03 16.15,24.89 16.15,22.91 R25.2 | C9.2 39.32,26.72 39.32,34.19 41.91,36.78 Q1.1
N$25
  Bottom 0.152: C9.1 42.06,26.57 43.13,26.57 44.5,25.2 46.94,25.2 48.31,26.57 C8.1
N$26  (via drill 0.35 layers 1-2, 0.35 layers 2-16)
  Top 0.152: v39.17,33.88 41.15,33.88 42.37,32.66 42.37,32.36 42.21,32.21 41.76,32.21 IC3.9
  Route2 0.152: v37.03,33.88 v39.17,33.88
  Bottom 0.152: v37.03,33.88 37.03,33.43 33.38,29.77 33.38,28.7 34.59,27.48 34.59,14.53 32.46,12.39 32.46,11.79 32.31,11.63 28.4,11.63 R21.1
N$27  (via drill 0.35)
  Top 0.152: v37.79,13.92 37.24,13.92 27.13,3.81 27.13,2.95 26.82,2.64 24.08,2.64 20.27,6.45 20.27,13.92 LED1.C
  Bottom 0.152: v37.79,13.92 39.01,13.92 R22.2
N$28  (via drill 0.35)
  Top 0.152: v37.64,32.05 37.79,32.21 39.47,32.21 IC3.2
  Bottom 0.152: v37.64,32.05 37.64,26.72 37.19,26.26 37.19,25.65 38.1,24.74 42.37,24.74 44.04,23.06 44.04,19.1 42.82,17.88 40.23,17.88 39.17,18.95 R23.2
N$29  (via drill 0.35 layers 1-2, 0.35 layers 2-16)
  Top 0.152: v38.56,31.14 38.71,31.29 39.47,31.29 IC3.4
  Route2 0.152: v38.56,31.14 43.89,31.14 46.94,28.09 46.94,27.48 43.59,24.13 v41.15,24.13
  Bottom 0.152: v41.15,24.13 40.39,24.13 R24.2
N$30
  Top 0.152: IC3.1 39.62,32.51 39.47,32.66 26.67,32.66 23.32,29.31 D2.C
N$31  (via drill 0.35 layers 2-16)  (1 unrouted)
  Route2 0.152: v29.21,3.81 27.37,5.65 26.12,5.65 21.59,10.18 v21.59,13.97
  Bottom 0.152: U$2.2 29.86,4.46 v29.21,3.81 | v21.59,13.97 20.6,13.97 20.38,14.19 20.18,14.19 20.05,14.06 20.05,13.99 20.02,13.97
N$34  (via drill 0.35)
  Top 0.152: v22.4,32.97 18.59,32.97 17.22,34.34 11.89,34.34 10.97,35.26 J1.2
  Bottom 0.152: v22.4,32.97 26.21,29.16 26.21,26.11 26.98,25.35 26.98,23.82 IC2.38
N$35
  Bottom 0.152: IC2.34 25.76,22.15 21.95,22.15 17.22,26.87 17.22,29.46 13.87,32.82 13.87,34.49 13.11,35.26 J1.4
N$37
  Bottom 0.152: 29.26,32.51 29.26,30.99 32.77,27.48 32.77,26.72 C10.2 | 29.26,32.51 29.26,33.43 U2.2 | 29.26,32.51 26.37,32.51 23.62,35.26 17.07,35.26 J1.8
N$41
  Bottom 0.152: IC2.37 26.37,23.82 26.37,25.5 25.91,25.96 25.91,29.01 22.55,32.36 17.98,32.36 17.07,33.27 J1.7
N$44
  Bottom 0.152: IC2.31 25.76,20.47 13.26,20.47 11.43,18.64 LED3.A
N$45
  Bottom 0.152: LED3.C 11.43,22.15 13.11,23.82 13.11,26.11 11.89,27.33 10.67,27.33 10.36,27.63 10.36,31.14 12.04,32.82 12.04,35.56 13.26,36.78 27.43,36.78 30.79,33.43 30.79,30.84 34.29,27.33 34.29,15.44 31.5,12.65 R15.2
N$46
  Bottom 0.152: IC2.30 25.76,20.02 22.1,20.02 19.36,17.27 10.36,17.27 9.75,17.88 9.75,23.22 11.43,24.89 LED4.A
N$47
  Bottom 0.152: LED4.C 11.43,28.4 14.48,28.4 16.15,26.72 R29.2
RA  (via drill 0.35)
  Top 0.152: v13.26,22.15 13.72,21.69 14.33,21.69 R2.1 | v53.34,27.63 51.97,27.63 51.66,27.33 51.66,26.57 50.9,25.81 49.84,25.81 49.07,26.57 48.77,26.57 R4.1
  Bottom 0.152: v13.26,22.15 12.5,21.39 12.5,21.23 12.34,21.08 10.52,21.08 10.36,21.23 10.36,22.91 10.97,23.52 12.34,23.52 12.8,23.98 12.8,25.96 12.5,26.26 10.36,26.26 8.99,24.89 8.99,13.31 19.96,2.34 34.44,2.34 37.19,5.08 37.19,14.22 38.1,15.14 39.78,15.14 41.15,13.77 41.15,13.16 41.6,12.7 47.24,12.7 JP2.SLEEVE 47.4,12.7 47.4,13.31 49.99,15.9 51.36,15.9 53.95,18.49 53.95,26.57 53.34,27.18 v53.34,27.63
REFOUT  (via drill 0.35 layers 1-2)
  Top 0.152: C6.2 54.1,31.75 53.19,32.66 51.97,32.66 51.05,31.75 R8.2 50.29,31.75 v48.92,30.38 | 40.69,21.54 40.69,19.71 41,19.41 41,18.8 40.39,18.19 34.59,18.19 34.29,18.49 34.29,19.71 33.83,20.17 32.16,20.17 31.55,20.78 30.48,20.78 29.72,21.54 C3.1 | 40.69,21.54 40.69,23.52 U3.8 | 40.69,21.54 v41.91,21.54
  Route2 0.152: v48.92,30.38 48.01,29.46 48.01,27.18 44.04,23.22 44.04,22.45 43.13,21.54 v41.91,21.54
RL  (via drill 0.35)
  Top 0.152: v46.63,24.28 46.63,26.57 R5.2
  Bottom 0.152: v46.63,24.28 46.63,22.61 47.24,22 JP2.TIP
SDN  (1 unrouted)
SIGNAL_OUT  (via drill 0.35, 0.35 layers 1-2)
  Top 0.152: v43.43,22.76 42.67,23.52 41.76,23.52 U3.10 | 30.33,18.34 29.72,18.95 C1.1 | 30.33,18.34 30.79,17.88 40.54,17.88 42.98,20.32 v43.43,20.32 47.09,16.66 53.8,16.66 60.35,23.22 60.35,36.63 60.2,36.78 48.92,36.78 44.96,32.82 44.96,31.75 R9.1 | v21.03,24.28 19.96,25.35 R16.2 | v30.02,17.88 30.33,18.19 30.33,18.34
  Route2 0.152: v21.03,24.28 21.03,23.82 24.08,20.78 27.13,20.78 v30.02,17.88
  Bottom 0.152: v43.43,20.32 v43.43,22.76